# Altium schematic sheet Sch.SchDoc
size 190 x 127 mm
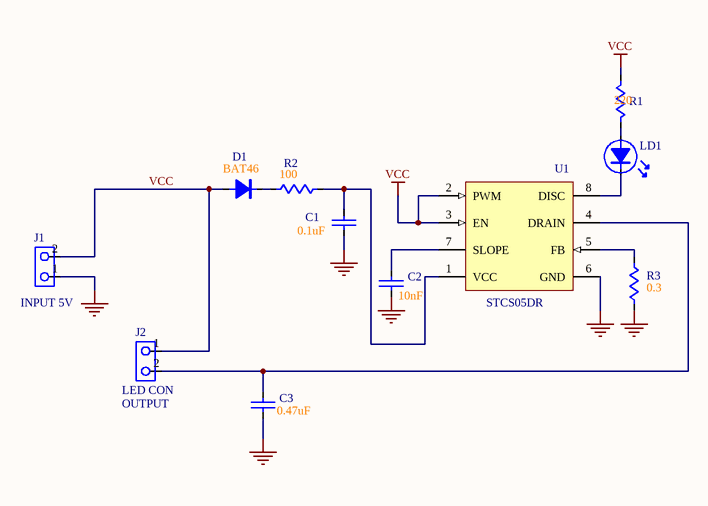
[diagram p0: Sch.SchDoc]

## Parts
C1  CAPNP  [0805 SMD CAP]  (value not drawn)
C2  CAPNP  [0805 SMD CAP]  (value not drawn)
C3  CAPNP  [0805 SMD CAP]  (value not drawn)
D1  schottky diode  [BAT46ZFILM DIODE]  (value not drawn)
J1  INPUT 5V  [CONN-5083-2P]
J2  LED CON  [CONN-5083-2P]
LD1  Osram 0805 SMD GRN LED  [LED3MM]  (value not drawn)
R1  RES1  [SMD1206N]  (value not drawn)
R2  RES1  [SMD1206N]  (value not drawn)
R3  RES1  [0805 SMD RES]  (value not drawn)
U1  STCS05DR  [SO8_M]

## Nets
GND: C1.2 C2.2 C3.2 J1.1 R3.1 U1.6(GND)
VCC: D1.A J1.2 J2.1 R1.2 U1.2(PWM) U1.3(EN)
NetC1_1: C1.1 R2.2 U1.1(VCC)
NetC2_1: C2.1 U1.7(SLOPE)
NetC3_1: C3.1 J2.2 U1.4(DRAIN)
NetD1_K: D1.K R2.1
NetLD1_A: LD1.A R1.1
NetLD1_K: LD1.K U1.8(DISC)
NetR3_2: R3.2 U1.5(FB)

## Notes on the sheet
- (near R1) 220
- (near D1) BAT46
- (near R2) 100
- (near C1) 0.1uF
- (near C2) 10nF
- (near R3) 0.3
- (near J2) OUTPUT
- (near C3) 0.47uF

## Library data of the parts
C1-C3 = CAPNP: Capacitor
D1 = D-1: Diode; Value: BAT46
J1 J2 = CONN2: Connector
LD1 = LED-1
U1 = STCS05ADR: 0.5 A Max Constant Current LED Driver, 8-Pin SO, Tape and Reel; DatasheetVersion: 1/07/2008; ComponentLink2Description: Datasheet; ComponentLink3URL: http://www.st.com/internet/com/TECHNICAL_RESOURCES/TECHNICAL_LITERATURE/PACKAGE_INFORMATION/CD00004680.pdf; PackageDescription: 8-Pin Small Outline Integrated Circuit 1.27 mm Pitch; PackageVersion: 1/12/2002; PackageReference: SO8; ComponentLink2URL: http://www.st.com/internet/com/TECHNICAL_RESOURCES/TECHNICAL_LITERATURE/DATASHEET/CD00187179.pdf; ComponentLink1Description: Manufacturer URL; ComponentLink3Description: Package Specification; ComponentLink1URL: http://www.st.com; Code_IPC: SOIC127P600-8; Code_JEDEC: MS-012-AA